# EAGLE design Coordinator (EAGLE 9.6.2)
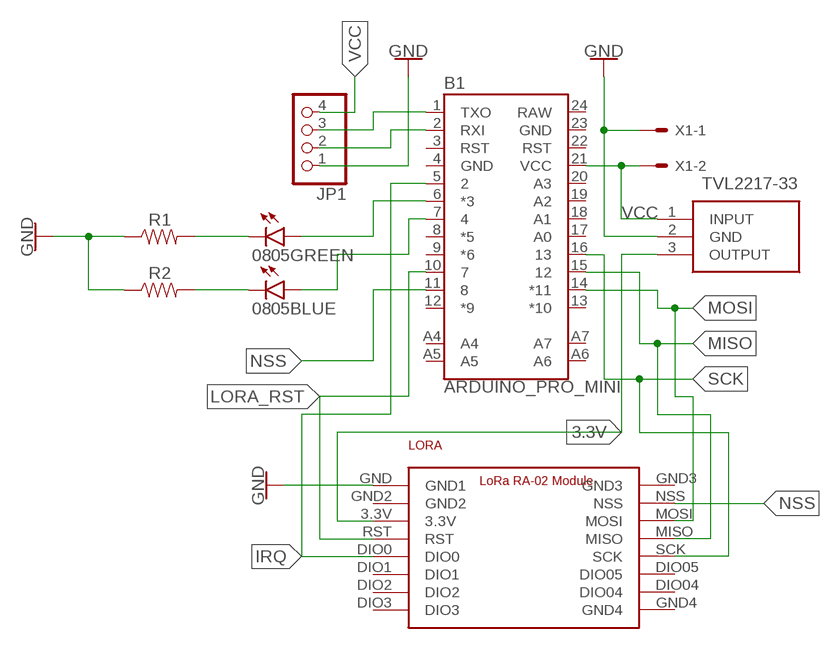
[diagram p0: schematic, sheet 1]

## Parts
0805BLUE  LEDCHIPLED_0805  [CHIPLED_0805]
0805GREEN  LEDCHIPLED_0805  [CHIPLED_0805]
B1  ARDUINO_PRO_MINI  [ARDUINO_PRO_MINI]
JP1  PINHD-1X4  [1X04]
LORA  LORA_RA-02_MODULE  [LORA_RA-02_MODULE_FOOTPRINT]
R1  RESISTOR0805  [0805]
R2  RESISTOR0805  [0805]
TVL2217-33  TLV2217-33KCSE3  [TO254P470X1016X1965-3P]
X1  JST-XH-02-PIN-LONG-PAD  [JST-XH-02-PACKAGE-LONG-PAD]

## Nets
3.3V: LORA.3.3V TVL2217-33.3(OUTPUT)
GND: JP1.1 LORA.GND(GND1) R1.1 R2.1 TVL2217-33.2(GND) X1.1
IRQ: B1.5 LORA.DIO0
LORA_RST: B1.10 LORA.RST
MISO: B1.15 LORA.MISO
MOSI: B1.14(*11) LORA.MOSI
N$5: B1.2(RXI) JP1.2
N$6: B1.1(TXO) JP1.3
N$9: 0805GREEN.A B1.6(*3)
N$10: 0805BLUE.A B1.7
N$11: 0805GREEN.C R1.2
N$12: 0805BLUE.C R2.2
NSS: B1.11 LORA.NSS
SCK: B1.16 LORA.SCK
VCC: B1.21(VCC) JP1.4 TVL2217-33.1(INPUT) X1.2
Unconnected: B1.3(RST) B1.8(*5) B1.9(*6) B1.12(*9) B1.13(*10) B1.17(A0) B1.18(A1) B1.19(A2) B1.20(A3) B1.22(RST) B1.A4 B1.A5 B1.A6 B1.A7 LORA.DIO1 LORA.DIO2 LORA.DIO3 LORA.DIO04 LORA.DIO05 LORA.GND2 LORA.GND3 LORA.GND4

## Power pins joined to a net without a drawn wire
GND: B1.4(GND) B1.23(GND)
RAW: B1.24(RAW)

## Library data of the parts
0805BLUE 0805GREEN = led:LED: LED OSRAM: - CHIPLED LG R971, LG N971, LY N971, LG Q971, LY Q971, LO R971, LY R971 LH N974, LH R974 LS Q976, LO Q976, LY Q976 LO Q996 - Hyper CHIPLED LW Q18S LB Q993, LB Q99A, LB R99A - SideLED LS A670, LO A670, LY A670, LG A670, LP A670 LB A673, LV A673, LT A673, LW A673 LH A674 LY A675 LS A676, LA A676, LO A676, LY A676, LW A676 LS A679, LY A679, LG A679 - Hyper Micro SIDELED® LS Y876, LA Y876, LO Y876, LY Y876 LT Y87S - SmartLED LW L88C, LW L88S LB L89C, LB L89S, LG L890 LS L89K, LO L89K, LY L89K LS L896, LA L896, LO L896, LY L896 - TOPLED LS T670, LO T670, LY T670, LG T670, LP T670 LSG T670, LSP T670, LSY T670, LOP T670, LYG T670 LG T671, LOG T671, LSG T671 LB T673, LV T673, LT T673, LW T673 LH T674 LS T676, LA T676, LO T676, LY T676, LB T676, LH T676, LSB T676, LW T676 LB T67C, LV T67C, LT T67C, LS T67K, LO T67K, LY T67K, LW E67C LS E67B, LA E67B, LO E67B, LY E67B, LB E67C, LV E67C, LT E67C LW T67C LS T679, LY T679, LG T679 LS T770, LO T770, LY T770, LG T770, LP T770 LB T773, LV T773, LT T773, LW T773 LH T774 LS E675, LA E675, LY E675, LS T675 LS T776, LA T776, LO T776, LY T776, LB T776 LHGB T686 LT T68C, LB T68C - Hyper Mini TOPLED® LB M676 - Mini TOPLED Santana® LG M470 LS M47K, LO M47K, LY M47K Source: http://www.osram.convergy.de LUXEON: - LUMILED® LXK2-PW12-R00, LXK2-PW12-S00, LXK2-PW14-U00, LXK2-PW14-V00 LXK2-PM12-R00, LXK2-PM12-S00, LXK2-PM14-U00 LXK2-PE12-Q00, LXK2-PE12-R00, LXK2-PE12-S00, LXK2-PE14-T00, LXK2-PE14-U00 LXK2-PB12-K00, LXK2-PB12-L00, LXK2-PB12-M00, LXK2-PB14-N00, LXK2-PB14-P00, LXK2-PB14-Q00 LXK2-PR12-L00, LXK2-PR12-M00, LXK2-PR14-Q00, LXK2-PR14-R00 LXK2-PD12-Q00, LXK2-PD12-R00, LXK2-PD12-S00 LXK2-PH12-R00, LXK2-PH12-S00 LXK2-PL12-P00, LXK2-PL12-Q00, LXK2-PL12-R00 Source: www.luxeon.com KINGBRIGHT: KA-3528ASYC Source: www.kingbright.com
B1 = SparkFun-Boards:ARDUINO_PRO_MINI: SparkFun Pro Mini Pro Mini compatible footprint. Dimensions: 0.7 x 1.3" PCB Thickness: 0.8mm SparkFun Products: 3.3V/8MHz <https://www.sparkfun.com/products/11114> 5V/16MHz <https://www.sparkfun.com/products/11113>
JP1 = pinhead:PINHD-1X4: PIN HEADER
LORA = LORA_RA-02_MODULE:LORA_RA-02_MODULE: LoRa Ra-02 module for pin socket.
R1 R2 = SparkFun-Resistors:RESISTOR: Generic Resistor Package
TVL2217-33 = TLV2217-33KCSE3:TLV2217-33KCSE3: Low-Dropout Fixed-Voltage Regulators Source: Datasheet <http://www.ti.com/lit/gpn/tlv2217>; ARROW_PART_NUMBER: TLV2217-33KCSE3; ARROW_PRICE-STOCK: https://www.arrow.com/en/products/tlv2217-33kcse3/texas-instruments; DESCRIPTION: Low-Dropout Fixed-Voltage Regulators; HEIGHT: 4.7mm; MANUFACTURER_NAME: Texas Instruments; MANUFACTURER_PART_NUMBER: TLV2217-33KCSE3; MOUSER_PART_NUMBER: 595-TLV2217-33KCSE3; MOUSER_PRICE-STOCK: https://www.mouser.co.uk/ProductDetail/Texas-Instruments/TLV2217-33KCSE3?qs=LVErsypW30y56XyeRJBjlA%3D%3D
X1 = Rembrandt Electronics - JST XH Connectors v1-0:JST-XH-02-PIN: JST XH Connector 2 Pin Wire to board connector. Pitch: 2,54 mm, (0.100") Number of pins: 2 Created by Rembrandt Electronics www.rembrandtelectronics.com

## Board
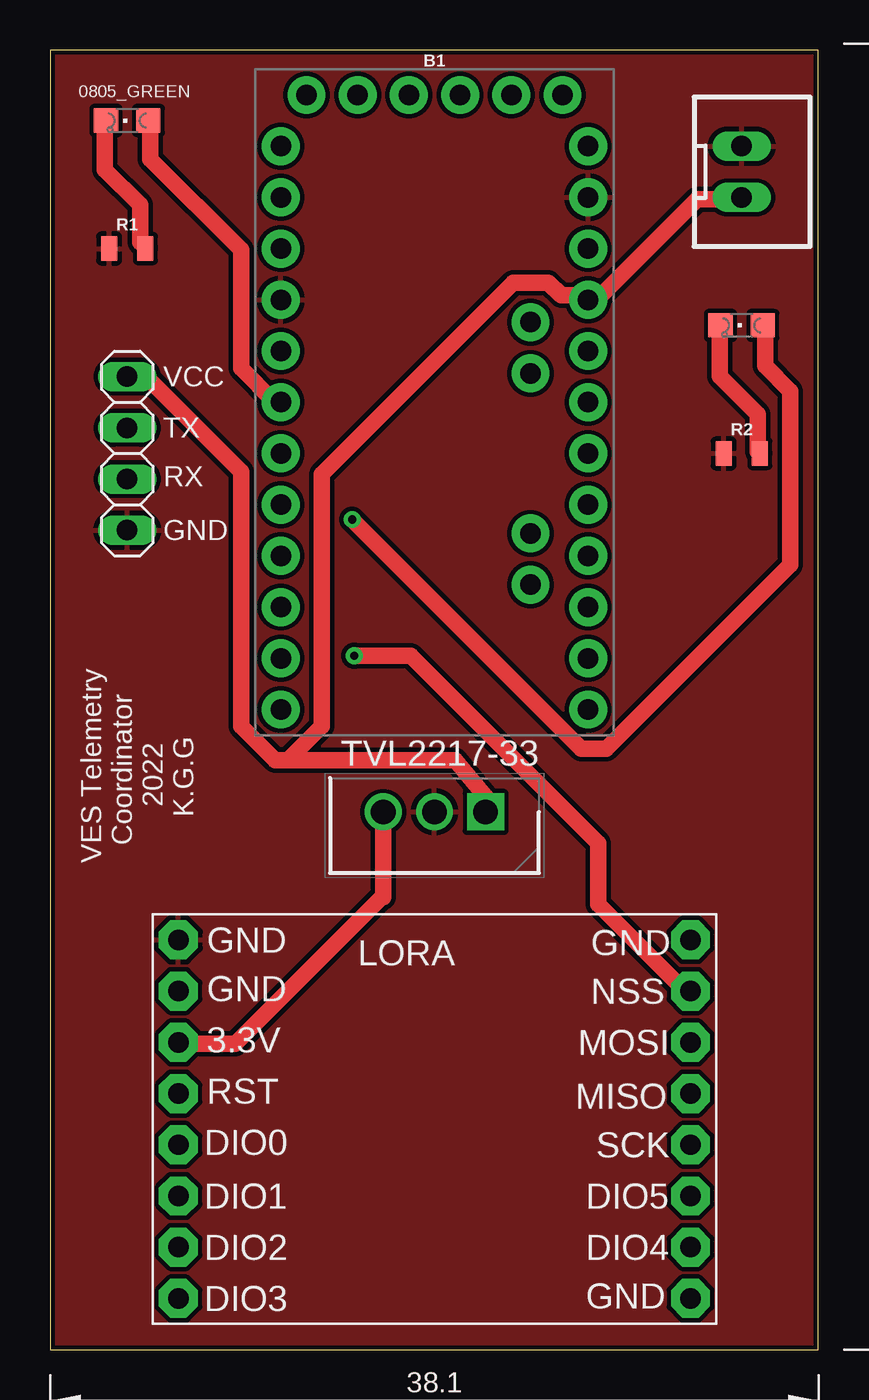
[diagram p1: board, top side]
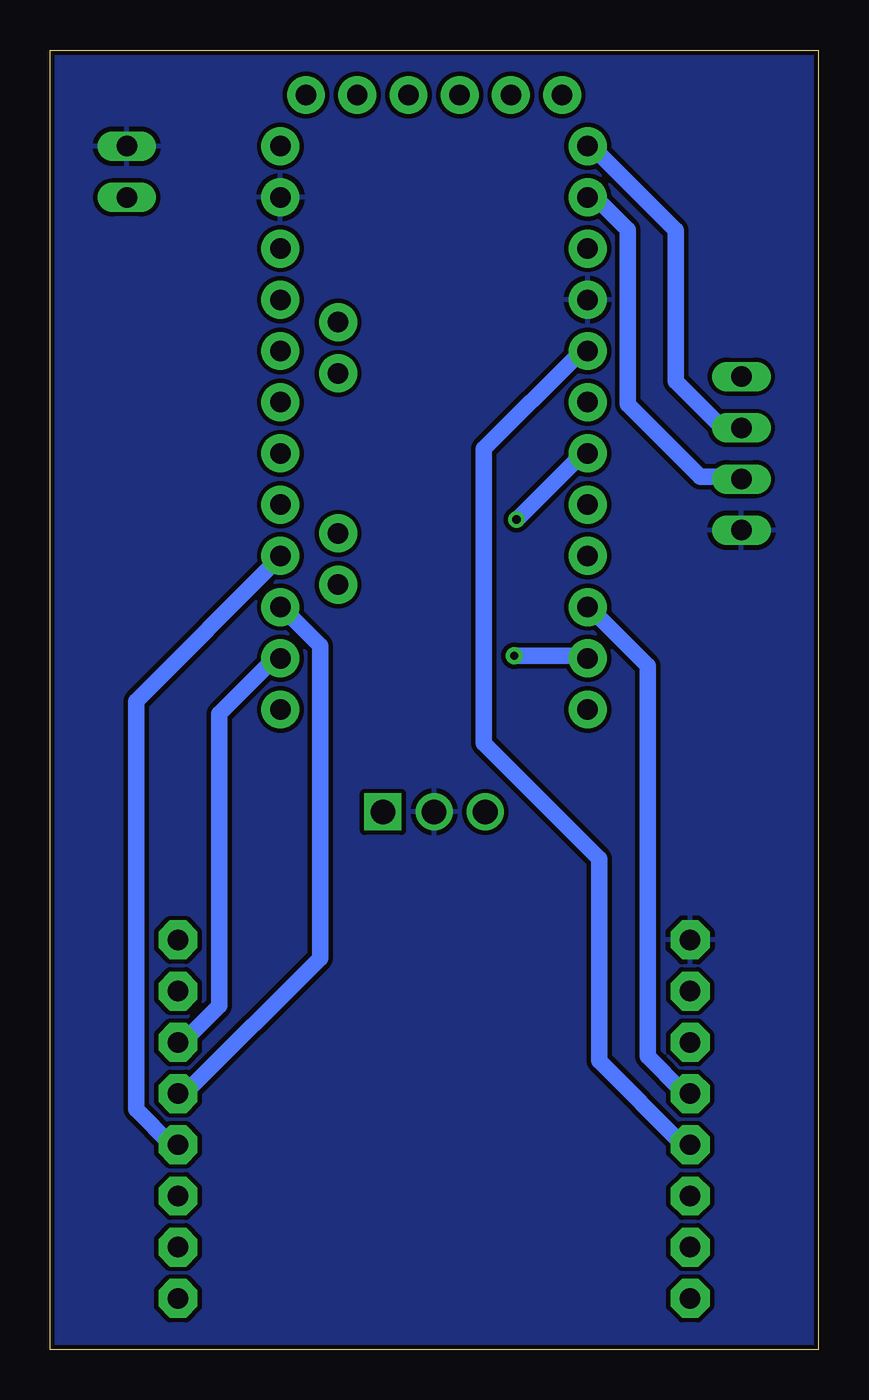
[diagram p2: board, bottom side, seen from below]

Size 38.08 x 64.44 mm. Coordinates in mm from the lower left corner, seen from the top.
Outline: 0,0 38.08,0 38.08,64.44 0,64.44 0,0
Copper layers (1*16): Top 0.035mm / dielectric 1.5mm / Bottom 0.035mm
Design rules "DRC_Colcircuitos": minimum track width 32mil, minimum drill 0.4mm, track to track 0.22mm, track to pad 0.22mm, pad to pad 0.22mm, via to via 0.22mm, smd to smd 0mil, copper to edge 0.22mm, drill to drill 0.6mm, minimum pad ring 0.22mm, minimum via ring 0.22mm, stop-mask expansion 0.05mm, vias tented up to drill 0mil, thermal gap 10mil

### Footprints (pad centres in the part's own frame; a part is rotated, then mirrored left to right if it is on the bottom)
CHIPLED_0805 = smd 1.2 x 1.2: A 0,-1.05; C 0,1.05
ARDUINO_PRO_MINI = drill 1.016 pad 1.88: 1 -7.62,12.7; 2 -7.62,10.16; 3 -7.62,7.62; 4 -7.62,5.08; 5 -7.62,2.54; 6 -7.62,0; 7 -7.62,-2.54; 8 -7.62,-5.08; 9 -7.62,-7.62; 10 -7.62,-10.16; 11 -7.62,-12.7; 12 -7.62,-15.24; 13 7.62,-15.24; 14 7.62,-12.7; 15 7.62,-10.16; 16 7.62,-7.62; 17 7.62,-5.08; 18 7.62,-2.54; 19 7.62,0; 20 7.62,2.54; 21 7.62,5.08; 22 7.62,7.62; 23 7.62,10.16; 24 7.62,12.7; A4 4.763,1.429; A5 4.763,3.969; A6 4.763,-9.049; A7 4.763,-6.509; BLK -6.35,15.24; GND -3.81,15.24; GRN 6.35,15.24; RXI 1.27,15.24; TXO 3.81,15.24; VCC -1.27,15.24
1X04 = drill 1.016 long: 1 -3.81,0; 2 -1.27,0; 3 1.27,0; 4 3.81,0
LORA_RA-02_MODULE_FOOTPRINT = drill 1.016 pad 1.93 octagon: 3.3V -12.7,3.81; DIO0 -12.7,-1.27; DIO1 -12.7,-3.81; DIO2 -12.7,-6.35; DIO3 -12.7,-8.89; DIO04 12.7,-6.35; DIO05 12.7,-3.81; GND -12.7,8.89; GND2 -12.7,6.35; GND3 12.7,8.89; GND4 12.7,-8.89; MISO 12.7,1.27; MOSI 12.7,3.81; NSS 12.7,6.35; RST -12.7,1.27; SCK 12.7,-1.27
0805 = smd 0.8 x 1.2: 1 -0.9,0; 2 0.9,0
TO254P470X1016X1965-3P = drill 1.22 pad 1.83 square: 1 0,0 | drill 1.22 pad 1.83: 2 2.54,0; 3 5.08,0
JST-XH-02-PACKAGE-LONG-PAD = drill 1.016 long: 1 -1.27,0; 2 1.27,0

### Placement (x,y rotation side)
0805BLUE  34.29,50.8 90 top
0805GREEN  3.81,60.96 90 top
B1  19.05,46.99 0 top
JP1  3.81,44.45 90 top
LORA  19.05,11.43 0 top
R1  3.81,54.61 0 top
R2  34.29,44.45 0 top
TVL2217-33  21.59,26.67 180 top
X1  34.29,58.42 270 top

### Tracks (layer width: path | path; a pad name or v marks a point on that pad's centre or on a via)
3.3V
  Top 0.813: TVL2217-33.3 16.51,22.43 16.45,22.45 9.16,15.17 6.45,15.17 LORA.3.3V
GND
  pour Top: 0,64.77 38.1,64.77 38.1,0 0,0
  pour Bottom: 0,64.77 38.1,64.77 38.1,0 0,0
IRQ
  Bottom 0.813: B1.5 11.45,49.42 11.83,49.42 16.58,44.67 16.58,30.07 10.85,24.34 10.85,14.31 6.7,10.17 6.45,10.17 LORA.DIO0
LORA_RST
  Bottom 0.813: B1.10 11.33,36.8 8.45,33.92 8.45,14.54 6.7,12.79 6.45,12.79 LORA.RST
MISO
  Bottom 0.813: B1.15 26.58,36.8 24.7,34.92 24.7,19.42 31.33,12.79 31.7,12.79 LORA.MISO
MOSI
  Bottom 0.813: B1.14 26.7,34.17 27.08,34.17 29.7,31.55 29.7,17.05 31.45,15.29 31.7,15.29 LORA.MOSI
N$5
  Bottom 0.813: JP1.2 3.83,43.3 5.85,43.3 9.45,46.9 9.45,55.55 10.95,57.05 11.33,57.05 B1.2
N$6
  Bottom 0.813: JP1.3 3.83,45.8 4.83,45.8 7.06,48.02 7.06,55.52 11.33,59.8 B1.1
N$9
  Top 0.813: 0805GREEN.A 4.95,60.92 4.95,59.05 9.45,54.55 9.45,48.67 11.08,47.05 11.33,47.05 B1.6
N$10  (via drill 0.4)
  Top 0.813: v14.96,41.17 26.34,29.8 27.58,29.8 36.7,38.92 36.7,47.55 35.45,48.8 35.45,50.8 0805BLUE.A
  Bottom 0.813: v14.96,41.17 v14.95,41.17 11.7,44.42 11.45,44.42 B1.7
N$11
  Top 0.813: R1.2 4.7,54.67 4.45,54.92 4.45,56.77 2.7,58.52 2.7,60.92 0805GREEN.C
N$12
  Top 0.813: R2.2 35.08,44.55 35.08,46.4 33.2,48.27 33.2,50.8 0805BLUE.C
NSS  (via drill 0.4)
  Top 0.813: v15.07,34.42 17.87,34.42 27.16,25.12 27.16,22.09 31.45,17.8 31.7,17.8 LORA.NSS
  Bottom 0.813: v15.07,34.42 12.09,34.42 B1.11
SCK
  Bottom 0.813: B1.16 26.7,39.3 33.83,32.17 33.83,11.92 32.08,10.17 31.83,10.17 LORA.SCK
VCC
  Top 0.813: X1.2 34.2,57.05 32.08,57.05 27.2,52.17 26.7,52.17 B1.21 26.33,52.3 25.33,52.3 24.7,52.92 22.95,52.92 13.45,43.42 13.45,30.92 11.77,29.23 | 11.77,29.23 20.09,29.23 21.59,27.43 TVL2217-33.1 | JP1.4 3.83,48.17 4.83,48.17 9.45,43.55 9.45,30.92 11.14,29.23 11.77,29.23

### Text on the board
tPlace: 2022 | K.G.G | Coordinator | VES Telemetry
tNames: 0805_GREEN | VCC | TX | RX | GND
tValues: 0805-150 | 0805_BLUE | 0805-100